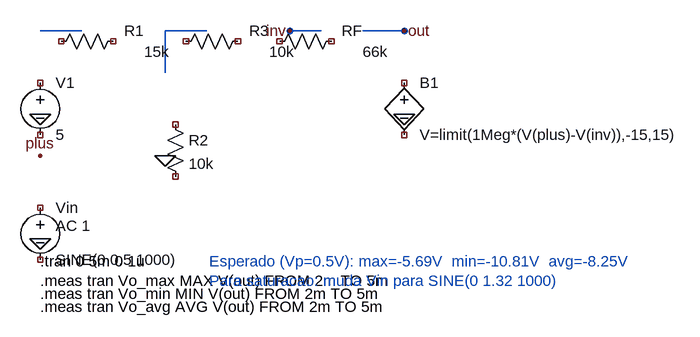
[diagram p0: schematic Q3_ltspice.asc]
Q3_ltspice.asc, the LTspice schematic file:
Version 4
SHEET 1 1000 700
WIRE 80 256 144 256
WIRE 272 256 336 256
WIRE 272 256 272 320
WIRE 464 256 512 256
WIRE 640 256 640 256
WIRE 464 256 464 256
WIRE 640 256 576 256
SYMBOL voltage 80 320 R0
WINDOW 123 0 0 Left 0
WINDOW 39 0 0 Left 0
SYMATTR InstName V1
SYMATTR Value 5
SYMBOL res 208 256 R90
WINDOW 0 0 -32 VRight 2
WINDOW 3 32 -32 VLeft 2
SYMATTR InstName R1
SYMATTR Value 15k
SYMBOL res 272 384 R0
SYMATTR InstName R2
SYMATTR Value 10k
SYMBOL res 400 256 R90
WINDOW 0 0 -32 VRight 2
WINDOW 3 32 -32 VLeft 2
SYMATTR InstName R3
SYMATTR Value 10k
SYMBOL res 544 256 R90
WINDOW 0 0 -32 VRight 2
WINDOW 3 32 -32 VLeft 2
SYMATTR InstName RF
SYMATTR Value 66k
SYMBOL voltage 80 512 R0
WINDOW 123 24 44 Left 2
WINDOW 39 0 0 Left 0
SYMATTR InstName Vin
SYMATTR Value SINE(0 0.5 1000)
SYMATTR Value2 AC 1
SYMBOL bv 640 320 R0
SYMATTR InstName B1
SYMATTR Value V=limit(1Meg*(V(plus)-V(inv)),-15,15)
FLAG 80 384 0
FLAG 272 448 0
FLAG 80 576 0
FLAG 640 384 0
FLAG 464 256 inv
FLAG 640 256 out
FLAG 80 448 plus
TEXT 80 610 Left 2 !.tran 0 5m 0 1u
TEXT 80 640 Left 2 !.meas tran Vo_max MAX V(out) FROM 2m TO 5m
TEXT 80 660 Left 2 !.meas tran Vo_min MIN V(out) FROM 2m TO 5m
TEXT 80 680 Left 2 !.meas tran Vo_avg AVG V(out) FROM 2m TO 5m
TEXT 340 610 Left 2 ;Esperado (Vp=0.5V): max=-5.69V  min=-10.81V  avg=-8.25V
TEXT 340 640 Left 2 ;Para saturacao: muda Vin para SINE(0 1.32 1000)

The netlist it stands for:
* Q3_ltspice.asc
V1 NC_01 NC_02 5
R1 NC_03 NC_04 15k
R2 NC_05 NC_06 10k
R3 NC_07 NC_08 10k
RF NC_09 NC_10 66k
Vin NC_11 NC_12 SINE(0 0.5 1000) AC 1
B1 NC_13 NC_14 V=limit(1Meg*(V(plus)-V(inv)),-15,15)
.tran 0 5m 0 1u
.meas tran Vo_max MAX V(out) FROM 2m TO 5m
.meas tran Vo_min MIN V(out) FROM 2m TO 5m
.meas tran Vo_avg AVG V(out) FROM 2m TO 5m
* Esperado (Vp=0.5V): max=-5.69V  min=-10.81V  avg=-8.25V
* Para saturacao: muda Vin para SINE(0 1.32 1000)
.backanno
.end